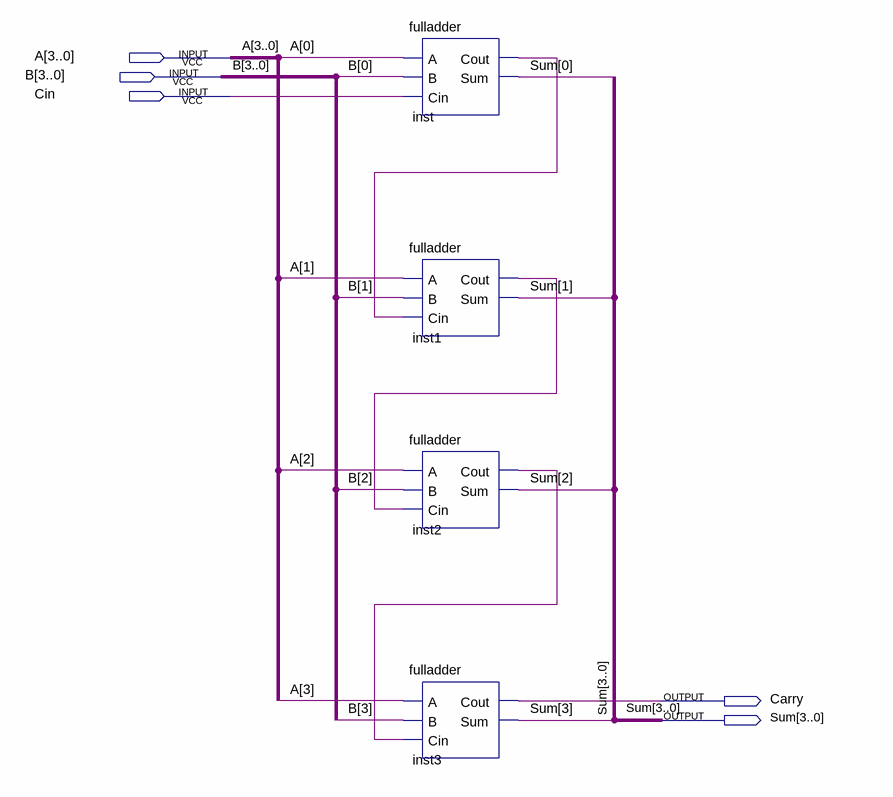
[diagram p0: schematic sheet]
// Quartus schematic adder4.bdf as structural Verilog: 4 symbols, 5 pins
module adder4 (
  input  [3:0] A,
  input  [3:0] B,
  input  Cin,
  output Carry,
  output [3:0] Sum
);

  wire inst1_cout, inst2_cout, inst_cout;

  fulladder inst (.A(A[0]), .B(B[0]), .Cin(Cin), .Cout(inst_cout), .Sum(Sum[0]));
  fulladder inst1 (.A(A[1]), .B(B[1]), .Cin(inst_cout), .Cout(inst1_cout), .Sum(Sum[1]));
  fulladder inst2 (.A(A[2]), .B(B[2]), .Cin(inst1_cout), .Cout(inst2_cout), .Sum(Sum[2]));
  fulladder inst3 (.A(A[3]), .B(B[3]), .Cin(inst2_cout), .Cout(Carry), .Sum(Sum[3]));
endmodule
